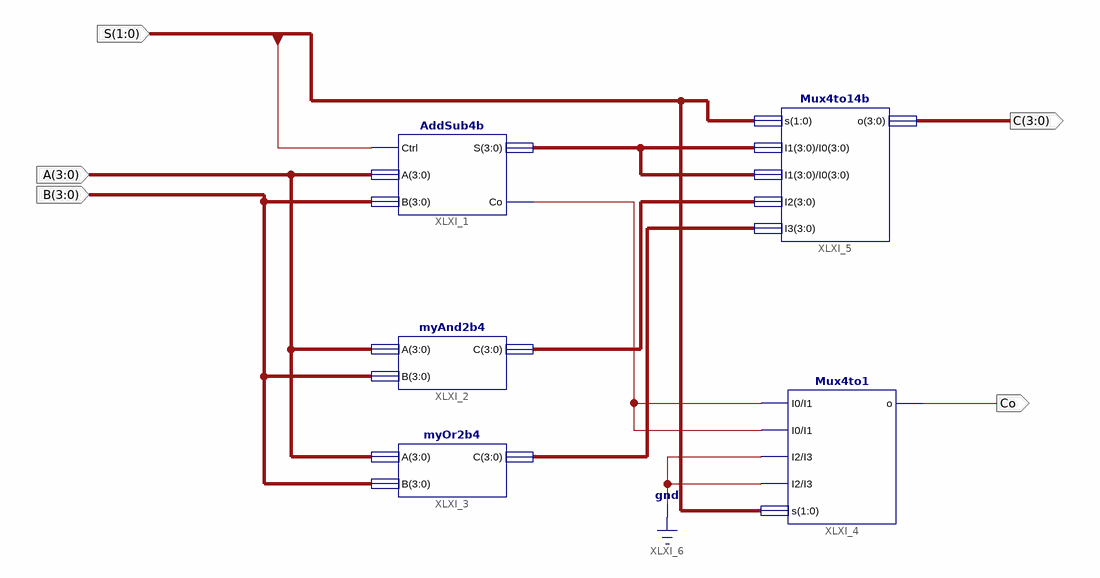
[diagram p0: schematic sheet 1]
// Xilinx ISE schematic myALU.sch (kintex7) as structural Verilog: 5 symbols, 5 ports
module myALU (
  input  [1:0] S,
  input  [3:0] A,
  input  [3:0] B,
  output [3:0] C,
  output Co
);

  wire XLXN_6;
  wire [3:0] XLXN_3, XLXN_4, XLXN_5;

  AddSub4b XLXI_1 (.Ctrl(S[0]), .A(A), .B(B), .S(XLXN_3), .Co(XLXN_6));
  myAnd2b4 XLXI_2 (.A(A), .B(B), .C(XLXN_4));
  myOr2b4 XLXI_3 (.A(A), .B(B), .C(XLXN_5));
  Mux4to1 XLXI_4 (.I0(XLXN_6), .I1(XLXN_6), .I2(1'b0), .I3(1'b0), .s(S), .o(Co));
  Mux4to14b XLXI_5 (.s(S), .I1(XLXN_3), .I0(XLXN_3), .I2(XLXN_4), .I3(XLXN_5), .o(C));
endmodule
